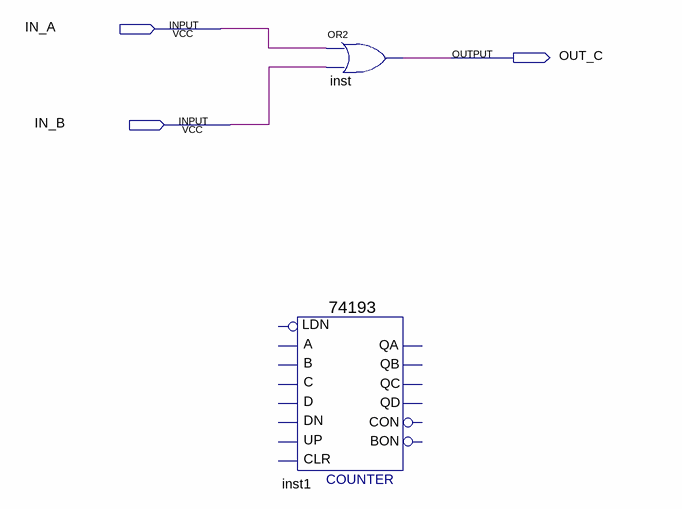
[diagram p0: schematic sheet]
// Quartus schematic 20211_el42_or1.bdf as structural Verilog: 2 symbols, 3 pins
module \20211_el42_or1  (
  input  IN_A,
  input  IN_B,
  output OUT_C
);

  \74193  inst1 ();  // open: D, C, B, A, CLR, UP, DN, LDN, QB, QA, CON, QD, QC, BON
  or inst (OUT_C, IN_A, IN_B);
endmodule
